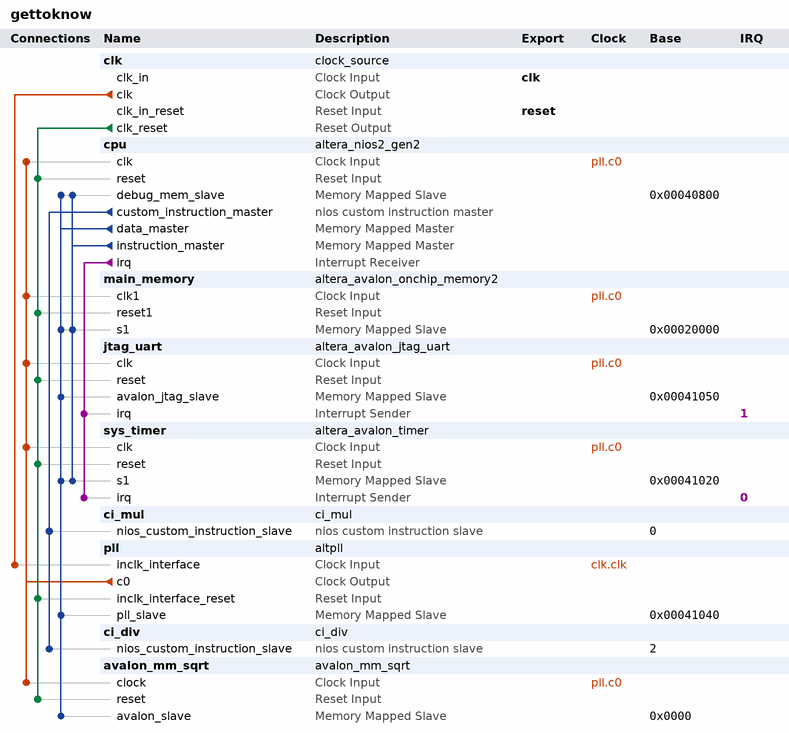
[diagram p0: system contents]
# Platform Designer (Qsys) system gettoknow, Cyclone IV E EP4CE115F29C7
# Parameters at their usual value, and those the tool derives, are not listed.
package require -exact qsys 22.1
create_system gettoknow
set_project_property DEVICE_FAMILY {Cyclone IV E}
set_project_property DEVICE EP4CE115F29C7

add_instance clk clock_source 22.1
set_instance_parameter_value clk clockFrequency 50000000

add_instance cpu altera_nios2_gen2 22.1
set_instance_parameter_value cpu dcache_size 2048
set_instance_parameter_value cpu exceptionSlave main_memory.s1
set_instance_parameter_value cpu icache_size 4096
set_instance_parameter_value cpu impl Fast
set_instance_parameter_value cpu resetSlave main_memory.s1

add_instance main_memory altera_avalon_onchip_memory2 22.1
set_instance_parameter_value main_memory dataWidth 32
set_instance_parameter_value main_memory dualPort false
set_instance_parameter_value main_memory initMemContent true
set_instance_parameter_value main_memory initializationFileName onchip_mem.hex
set_instance_parameter_value main_memory memorySize 125000

add_instance jtag_uart altera_avalon_jtag_uart 22.1
set_instance_parameter_value jtag_uart simInteractiveOptions NO_INTERACTIVE_WINDOWS

add_instance sys_timer altera_avalon_timer 22.1
set_instance_parameter_value sys_timer period 1
set_instance_parameter_value sys_timer periodUnits MSEC

add_instance ci_mul ci_mul 1.0

add_instance pll altpll 22.1
set_instance_parameter_value pll CLK0_DIVIDE_BY 1
set_instance_parameter_value pll CLK0_MULTIPLY_BY 2
set_instance_parameter_value pll INCLK0_INPUT_FREQUENCY 20000
set_instance_parameter_value pll PORT_ARESET PORT_UNUSED
set_instance_parameter_value pll PORT_LOCKED PORT_UNUSED
set_instance_parameter_value pll PORT_clk1 PORT_UNUSED
set_instance_parameter_value pll PORT_clk2 PORT_UNUSED
set_instance_parameter_value pll PORT_clk3 PORT_UNUSED

add_instance ci_div ci_div 1.0

add_instance avalon_mm_sqrt avalon_mm_sqrt 1.0

# connections
add_connection clk.clk pll.inclk_interface clock
add_connection pll.c0 avalon_mm_sqrt.clock clock
add_connection pll.c0 cpu.clk clock
add_connection pll.c0 jtag_uart.clk clock
add_connection pll.c0 main_memory.clk1 clock
add_connection pll.c0 sys_timer.clk clock
add_connection clk.clk_reset avalon_mm_sqrt.reset reset
add_connection clk.clk_reset cpu.reset reset
add_connection clk.clk_reset jtag_uart.reset reset
add_connection clk.clk_reset main_memory.reset1 reset
add_connection clk.clk_reset pll.inclk_interface_reset reset
add_connection clk.clk_reset sys_timer.reset reset
add_connection cpu.data_master avalon_mm_sqrt.avalon_slave avalon
set_connection_parameter_value cpu.data_master/avalon_mm_sqrt.avalon_slave baseAddress 0x0000
add_connection cpu.data_master cpu.debug_mem_slave avalon
set_connection_parameter_value cpu.data_master/cpu.debug_mem_slave baseAddress 0x00040800
add_connection cpu.data_master jtag_uart.avalon_jtag_slave avalon
set_connection_parameter_value cpu.data_master/jtag_uart.avalon_jtag_slave baseAddress 0x00041050
add_connection cpu.data_master main_memory.s1 avalon
set_connection_parameter_value cpu.data_master/main_memory.s1 baseAddress 0x00020000
add_connection cpu.data_master pll.pll_slave avalon
set_connection_parameter_value cpu.data_master/pll.pll_slave baseAddress 0x00041040
add_connection cpu.data_master sys_timer.s1 avalon
set_connection_parameter_value cpu.data_master/sys_timer.s1 baseAddress 0x00041020
add_connection cpu.instruction_master cpu.debug_mem_slave avalon
set_connection_parameter_value cpu.instruction_master/cpu.debug_mem_slave baseAddress 0x00040800
add_connection cpu.instruction_master main_memory.s1 avalon
set_connection_parameter_value cpu.instruction_master/main_memory.s1 baseAddress 0x00020000
add_connection cpu.instruction_master sys_timer.s1 avalon
set_connection_parameter_value cpu.instruction_master/sys_timer.s1 baseAddress 0x00041020
add_connection cpu.irq jtag_uart.irq interrupt
set_connection_parameter_value cpu.irq/jtag_uart.irq irqNumber 1
add_connection cpu.irq sys_timer.irq interrupt
set_connection_parameter_value cpu.irq/sys_timer.irq irqNumber 0
add_connection cpu.custom_instruction_master ci_div.nios_custom_instruction_slave nios_custom_instruction
set_connection_parameter_value cpu.custom_instruction_master/ci_div.nios_custom_instruction_slave CIName ci_div
set_connection_parameter_value cpu.custom_instruction_master/ci_div.nios_custom_instruction_slave baseAddress 2
add_connection cpu.custom_instruction_master ci_mul.nios_custom_instruction_slave nios_custom_instruction
set_connection_parameter_value cpu.custom_instruction_master/ci_mul.nios_custom_instruction_slave CIName ci_mul
set_connection_parameter_value cpu.custom_instruction_master/ci_mul.nios_custom_instruction_slave baseAddress 0

# exported interfaces
add_interface clk clock sink
set_interface_property clk EXPORT_OF clk.clk_in
add_interface reset reset sink
set_interface_property reset EXPORT_OF clk.clk_in_reset

set_interconnect_requirement {$system} qsys_mm.clockCrossingAdapter HANDSHAKE
set_interconnect_requirement {$system} qsys_mm.maxAdditionalLatency 1

save_system gettoknow.qsys
